# Altium schematic sheet [MP] TTL UART USB.SchDoc
size 254 x 208 mm; SheetNumber: 3; SheetTotal: 8
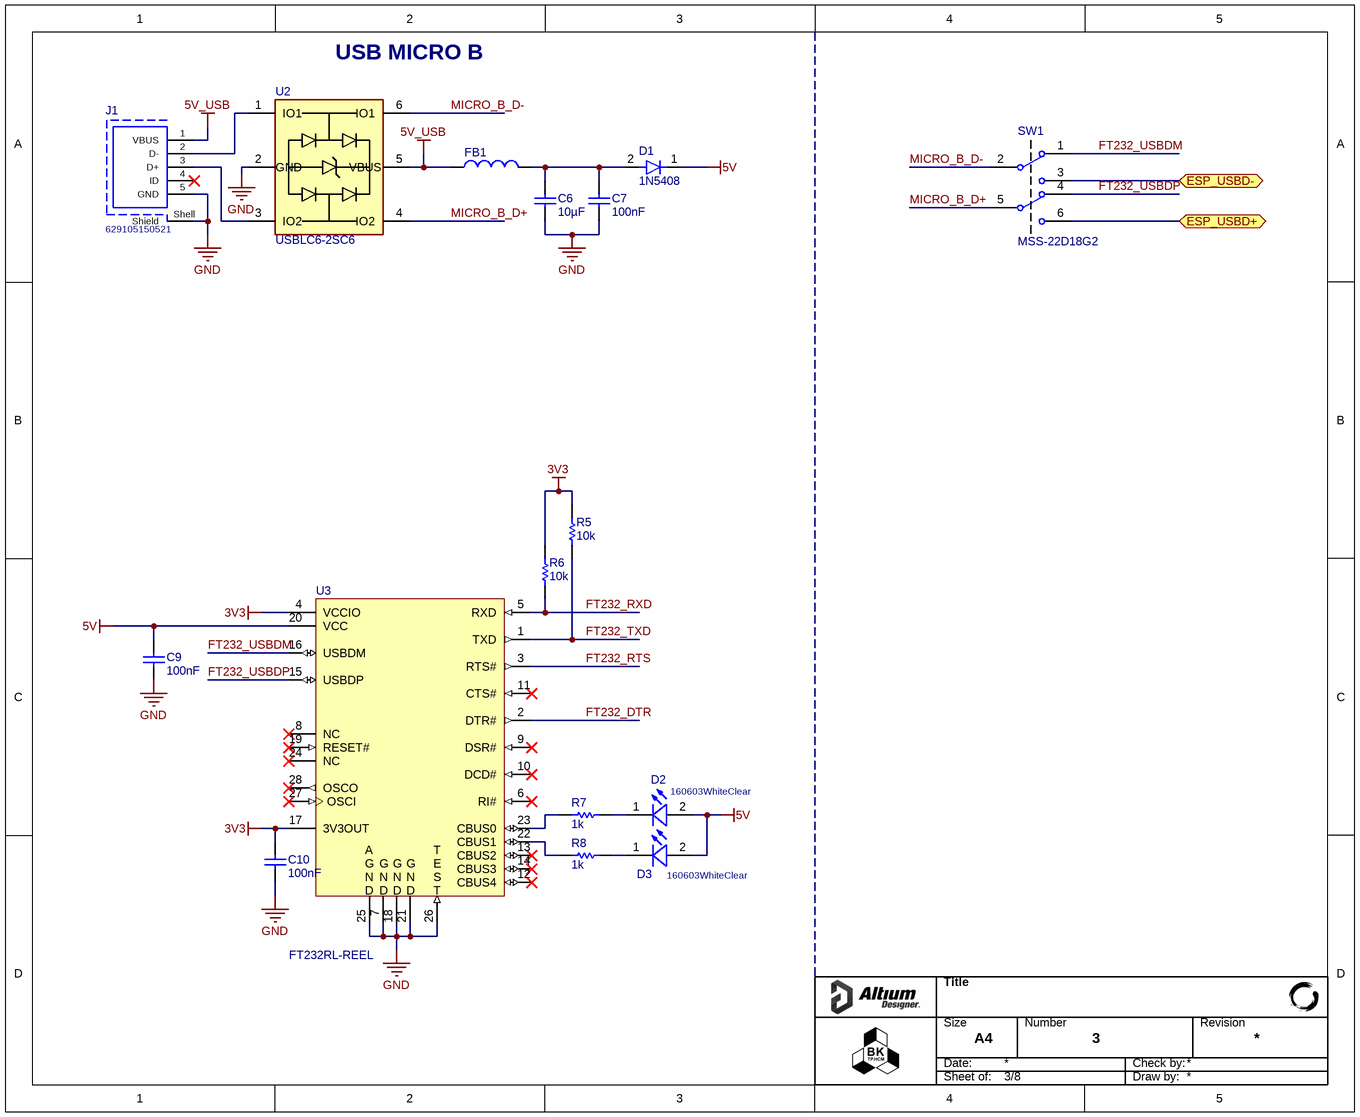
[diagram p0: [MP] TTL UART USB.SchDoc]

## Parts
C6  value 10µF  [CAP_0603]  (hidden comment: 0106031061010)
C7  value 100nF  [CAP_0603]  (hidden comment: 0106031041050)
C9  value 100nF  [CAP_0603]  (hidden comment: 0106031041050)
C10  value 100nF  [CAP_0603]  (hidden comment: 0106031041050)
D1  1N5408  [FAIR-SMA-2_B_V]
D2  160603WhiteClear  [WL-SMCW_0603_H=0.7mm]
D3  160603WhiteClear  [WL-SMCW_0603_H=0.7mm]
FB1  CBG160808U601T  [CBG160808U601T-Footprint]  (value not drawn)
J1  629105150521  [629105150521]
R5  value 10k  [RES_0603]  (hidden comment: 0006031031)
R6  value 10k  [RES_0603]  (hidden comment: 0006031031)
R7  value 1k  [RES_0603]  (hidden comment: 0006031021)
R8  value 1k  [RES_0603]  (hidden comment: 0006031021)
SW1  MSS-22D18G2  [MSS-22D18G2]
U2  USBLC6-2SC6  [USBLC6-2SC6-Footprint-1]
U3  FT232RL-REEL  [FTDI-SSOP-28_L]

## Ports
ESP_USBD+ (bidir), ESP_USBD- (bidir)

## Nets
3V3: C10.2 R5.2 R6.2 U3.4(VCCIO) U3.17(3V3OUT)
5V: C9.2 D1.1(K) D2.2(A) D3.2(A) U3.20(VCC)
5V_USB: FB1.1 J1.1(VBUS) U2.5(VBUS)
GND: C6.1 C7.2 C9.1 C10.1 J1.5(GND) J1.Shell(Shield) U2.2(GND) U3.7(GND) U3.18(GND) U3.21(GND) U3.25(AGND) U3.26(TEST)
ESP_USBD+: SW1.6(2-2) ; port ESP_USBD+
ESP_USBD-: SW1.3(1-2) ; port ESP_USBD-
FT232_DTR: U3.2(DTR#)
FT232_RTS: U3.3(RTS#)
FT232_RXD: R6.1 U3.5(RXD)
FT232_TXD: R5.1 U3.1(TXD)
FT232_USBDM: SW1.1(1-1) U3.16(USBDM)
FT232_USBDP: SW1.4(2-1) U3.15(USBDP)
MICRO_B_D+: SW1.5(COM2) U2.4(IO2)
MICRO_B_D-: SW1.2(COM1) U2.6(IO1)
NetC6_2: C6.2 C7.1 D1.2(A) FB1.2
NetD2_1: D2.1(K) R7.1
NetD3_1: D3.1(K) R8.1
NetJ1_2: J1.2(D-) U2.1(IO1)
NetJ1_3: J1.3(D+) U2.3(IO2)
NetR7_2: R7.2 U3.23(CBUS0)
NetR8_2: R8.2 U3.22(CBUS1)

Not connected (* = marked no-connect by the designer): J1 4(ID)*; U3 6(RI#)* 8(NC)* 9(DSR#)* 10(DCD#)* 11(CTS#)* 12(CBUS4)* 13(CBUS2)* 14(CBUS3)* 19(RESET#)* 24(NC)* 27(OSCI)* 28(OSCO)*

## Notes on the sheet
- (near U2) USB MICRO B
- Title
- Size
- Date:
- A4
- Number
- Check by:
- Revision
- Sheet of:
- Draw by:
- (in symbol CMP-015-00000-6) A / G / N / D; G / N / D; T / E / S / T

## Library data of the parts
C6 = CMP-001-00181-3: CAP, size 0603, 10 uF, 10 VDC, 10%; Manufacturer: Samsung Electro-Mechanics; Manufacturer Part Number: CL10A106KP8NNNC; Voltage Rating DC: 10 VDC; Supplier 2 Part Number: 1276-1192-2-ND; Pins: 2; Design Item ID: 0106031061010; Supplier 2 URL: https://www.digikey.com/en/products/detail/samsung-electro-mechanics/cl10a106kp8nnnc/3886850; Source: Capacitor_0603_10_percent.SchLib; Component Type: Standard; Operating Temperature Min: - 40 C; Packaging: Tape and Reel; Supplier 3 Part Number: N/A; Supplier 1 URL: https://www.mouser.vn/ProductDetail/Samsung-Electro-Mechanics/CL10A106KP8NNNC?qs=X6jEic%2FHinAlyfRHj7fKwg%3D%3D; LCSC Part #: C19702; Supplier 3 URL: https://www.thegioiic.com/tu-gom-0603-10uf-25v; ComponentLink1Description: Datasheet; Operating Temperature Max: + 85 C; ComponentLink1URL: https://www.mouser.vn/datasheet/2/585/MLCC-1837944.pdf; Mount: SMD/SMT; Case/Package: 0603; Supplier 1 Part Number: 187-CL10A106KP8NNNC; Tolerance: 10%
C7 C9 C10 = CMP-001-00176-3: CAP, size 0603, 100 nF, 50 VDC, 10%; Manufacturer Part Number: CGA3E3X8R1H104K080AE; Manufacturer: TDK; Voltage Rating DC: 50 VDC; Source: Capacitor_0603_10_percent.SchLib; Operating Temperature Min: - 40 C; Supplier 3 URL: https://www.thegioiic.com/tu-gom-0603-100nf-0-1uf-50v; Supplier 1 Part Number: 810-CGA3E3X8R1H104KA; Mount: SMD/SMT; Supplier 1 URL: https://www.mouser.com/ProductDetail/TDK/CGA3E3X8R1H104K080AE?qs=nQSIdc08i%252Bd8g3IRRgU2bw%3D%3D&utm_source=mouser-refine-download&utm_medium=file&utm_campaign=CGA3E3X8R1H104K080AE&utm_content=TDK; Packaging: Tape and Reel; Supplier 3 Part Number: N/A; LCSC Part #: C14663; ComponentLink1Description: Datasheet; Operating Temperature Max: + 85 C; Design Item ID: 0106031041050; Supplier 2 URL: https://www.digikey.com/en/products/detail/tdk-corporation/cga3e3x8r1h104k080ae/5809262; Component Type: Standard; Supplier 2 Part Number: 445-173697-2-ND; Case/Package: 0603; Tolerance: 10%; ComponentLink1URL: https://product.tdk.com/system/files/dam/doc/product/capacitor/ceramic/mlcc/catalog/mlcc_automotive_soft_en.pdf?ref_disty=mouser; Pins: 2
D1 = CMP-004-00058-1: Rectifier Diode, Schottky, 1 Phase, 1 Element, 3A, 1KV, Silicon; Forward Voltage: 475mV; Pins: 2; RoHS Compliant: Yes; Max Operating Temperature: 125°C
D2 D3 = CMP-004-00040-2: WL-SMCW SMT Mono-color Chip LED Waterclear, size 0603, White; Type: Clear; ComponentLink2Description: Supplier 1 URL; Supplier 1 Name: Mouser; ComponentLink3URL: https://www.digikey.com/en/products/detail/inolux/IN-S63AT5UW/7604931; Supplier 3 URL: https://www.thegioiic.com/led-trang-0603-dan-smd-trong-suot; ComponentLink1URL: N/A; Source: WL-SMCW_0603.SchLib; Component Type: Standard; ComponentLink1Description: Datasheet link; Supplier 2 Name: Digi-Key; ComponentLink3Description: Supplier 2 URL; Pins: 2; ComponentLink4Description: Supplier 3 URL; ComponentLink2URL: https://www.mouser.vn/ProductDetail/ROHM-Semiconductor/SMLA12WBN7W1?qs=TCDPyi3sCW1efPV6dhaUAA%3D%3D; Supplier 2 SN: 1830-1063-2-ND; Supplier 2 URL: https://www.digikey.com/en/products/detail/inolux/IN-S63AT5UW/7604931; Supplier 3 Name: ICDayRoi; Size: 0603; Design Item ID: 160603WhiteClear; Supplier 1 SN: 755-SMLA12WBN7W1; Color: White; Supplier 3 SN: N/A; ComponentLink4URL: https://www.thegioiic.com/led-trang-0603-dan-smd-trong-suot; Supplier 1 URL: https://www.mouser.vn/ProductDetail/ROHM-Semiconductor/SMLA12WBN7W1?qs=TCDPyi3sCW1efPV6dhaUAA%3D%3D; Value: White
FB1 = CMP-006-00022-1: 0603 600Ω ±25% DCR=0.5Ω 0.2A
J1 = CMP-002-00305-5: Micro USB 2.0 Type B Receptacle WR-COM, Horizontal, SMT, with Pegs, High Current at Pin 1 & Pin 5
R5 R6 = CMP-009-00187-5: RES, size 0603, 10 KOhm, 1/10 W, 1%; Manufacturer Part Number: RC0603FR-0710KL; Manufacturer: YAGEO; Rated Power: 1/10 W; Source: Resistor_0603.SchLib; Pins: 2; Case/Package: 0603; Packaging: Tape and Reel; ComponentLink1Description: Datasheet; Component Type: Standard; Supplier 1 URL: N/A; Design Item ID: 0006031031; Supplier 2 Part Number: 311-10.0KHRTR-ND; Supplier 2 URL: https://www.digikey.com/en/products/detail/yageo/rc0603fr-0710kl/726880; Operating Temperature Max: + 85 C; Mount: SMD/SMT; Supplier 3 URL: N/A; Supplier 1 Part Number: N/A; Operating Temperature Min: - 40 C; LCSC Part #: C98220; Supplier 3 Part Number: N/A; ComponentLink1URL: https://fscdn.rohm.com/en/products/databook/datasheet/passive/resistor/chip_resistor/esr-e.pdf; Tolerance: 1%
R7 R8 = CMP-009-00185-5: RES, size 0603, 1 KOhm, 1/10 W, 1%; Manufacturer Part Number: RC0603FR-071KL; Manufacturer: YAGEO; Rated Power: 1/10 W; Tolerance: 1%; Supplier 1 URL: https://www.mouser.vn/ProductDetail/YAGEO/RC0603FR-071KL?qs=VU8sRB4EgwApHsk4rF%2F3zg%3D%3D; ComponentLink1URL: https://www.yageo.com/upload/media/product/productsearch/datasheet/rchip/PYu-SR_20105_RoHS_L_10.pdf; Supplier 3 URL: N/A; Case/Package: 0603; Supplier 2 URL: https://www.digikey.com/en/products/detail/yageo/rc0603fr-071kl/726843; Mount: SMD/SMT; Supplier 2 Part Number: 311-1.00KHRTR-ND; Source: Resistor_0603.SchLib; Packaging: Tape and Reel; Component Type: Standard; Design Item ID: 0006031021; ComponentLink1Description: Datasheet; Operating Temperature Max: + 85 C; Supplier 3 Part Number: N/A; Operating Temperature Min: - 40 C; LCSC Part #: C22548; Supplier 1 Part Number: 603-RC0603FR-071KL; Pins: 2
SW1 = CMP-011-00019-3: Slide switch 2.5
U2 = CMP-004-00055-2: 17V Clamp 5A (8/20Âµs) Ipp Tvs Diode Surface Mount SOT-23-6
U3 = CMP-015-00000-6: USB UART IC, -0.5 to 6 V, 24 mA, -40 to 85 degC, 28-Pin SSOP, RoHS, Tape and Reel; Manufacturer: Future Technology Devices International (FTDI); Nominal Supply Voltage: 5V; Max Supply Voltage: 5.25V; Min Supply Voltage: 3.3V; Channels: 1; Data Rate: 3Mbps; Max Operating Temperature: 85°C; Pins: 16; Locally Supplier URL: https://www.thegioiic.com/ft232rl-ic-usb-to-serial-uart-28-ssop; RoHS Compliant: True; Packaging: TapeandReel; Min Operating Temperature: -40°C; Interface: UART; Datasheet Version: Rev. 1.04, 02/2006; Locally Supplier Name: Thegioiic; Case/Package: SSOP; Manufacturer URL: http://www.ftdichip.com/; Package Quantity: 2000; Datasheet URL: http://datasheet.octopart.com/FT232RL-FTDI-datasheet-120501.pdf